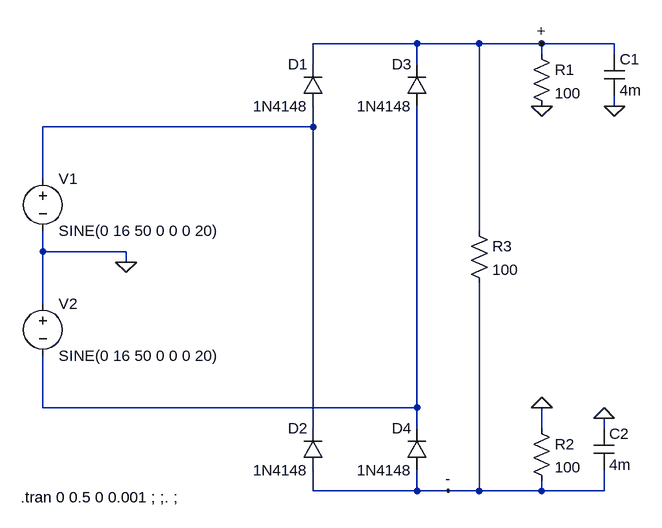
[diagram p0: schematic Diode_rectifier.asc]
Diode_rectifier.asc, the LTspice schematic file:
Version 4
SHEET 1 968 680
WIRE 592 -176 432 -176
WIRE 688 -176 592 -176
WIRE 784 -176 688 -176
WIRE 896 -176 784 -176
WIRE 784 -160 784 -176
WIRE 896 -160 896 -176
WIRE 432 -144 432 -176
WIRE 592 -144 592 -176
WIRE 896 -80 896 -96
WIRE 432 -48 432 -80
WIRE 432 -48 16 -48
WIRE 16 32 16 -48
WIRE 688 112 688 -176
WIRE 16 144 16 112
WIRE 144 144 16 144
WIRE 144 160 144 144
WIRE 16 224 16 144
WIRE 16 384 16 304
WIRE 592 384 592 -80
WIRE 592 384 16 384
WIRE 432 416 432 -48
WIRE 592 416 592 384
WIRE 784 416 784 384
WIRE 880 416 880 400
WIRE 432 512 432 480
WIRE 592 512 592 480
WIRE 592 512 432 512
WIRE 640 512 592 512
WIRE 688 512 688 192
WIRE 688 512 640 512
WIRE 784 512 784 496
WIRE 784 512 688 512
WIRE 880 512 880 480
WIRE 880 512 784 512
FLAG 144 160 0
FLAG 784 -80 0
FLAG 784 384 0
FLAG 784 -176 +
FLAG 640 512 -
FLAG 880 400 0
FLAG 896 -80 0
SYMBOL voltage 16 16 R0
WINDOW 123 0 0 Left 0
WINDOW 39 0 0 Left 0
SYMATTR InstName V1
SYMATTR Value SINE(0 16 50 0 0 0 20)
SYMBOL voltage 16 208 R0
WINDOW 123 0 0 Left 0
WINDOW 39 0 0 Left 0
SYMATTR InstName V2
SYMATTR Value SINE(0 16 50 0 0 0 20)
SYMBOL diode 448 -80 R180
WINDOW 0 24 64 Left 2
WINDOW 3 24 0 Left 2
SYMATTR InstName D1
SYMATTR Value 1N4148
SYMBOL diode 448 480 R180
WINDOW 0 24 64 Left 2
WINDOW 3 24 0 Left 2
SYMATTR InstName D2
SYMATTR Value 1N4148
SYMBOL diode 608 -80 R180
WINDOW 0 24 64 Left 2
WINDOW 3 24 0 Left 2
SYMATTR InstName D3
SYMATTR Value 1N4148
SYMBOL diode 608 480 R180
WINDOW 0 24 64 Left 2
WINDOW 3 24 0 Left 2
SYMATTR InstName D4
SYMATTR Value 1N4148
SYMBOL res 768 -176 R0
SYMATTR InstName R1
SYMATTR Value 100
SYMBOL res 768 400 R0
SYMATTR InstName R2
SYMATTR Value 100
SYMBOL res 672 96 R0
SYMATTR InstName R3
SYMATTR Value 100
SYMBOL cap 880 -160 R0
SYMATTR InstName C1
SYMATTR Value 4m
SYMBOL cap 864 416 R0
SYMATTR InstName C2
SYMATTR Value 4m
TEXT -18 522 Left 2 !.tran 0 0.5 0 0.001 ; ;. ;

The netlist it stands for:
* Diode_rectifier.asc
V1 N001 0 SINE(0 16 50 0 0 0 20)
V2 0 N002 SINE(0 16 50 0 0 0 20)
D1 N001 + 1N4148
D2 - N001 1N4148
D3 N002 + 1N4148
D4 - N002 1N4148
R1 + 0 100
R2 0 - 100
R3 + - 100
C1 + 0 4m
C2 0 - 4m
.model D D
.lib standard.dio
.tran 0 0.5 0 0.001 ; ;. ;
.backanno
.end